# EAGLE design Buck 100V (EAGLE 6.2)
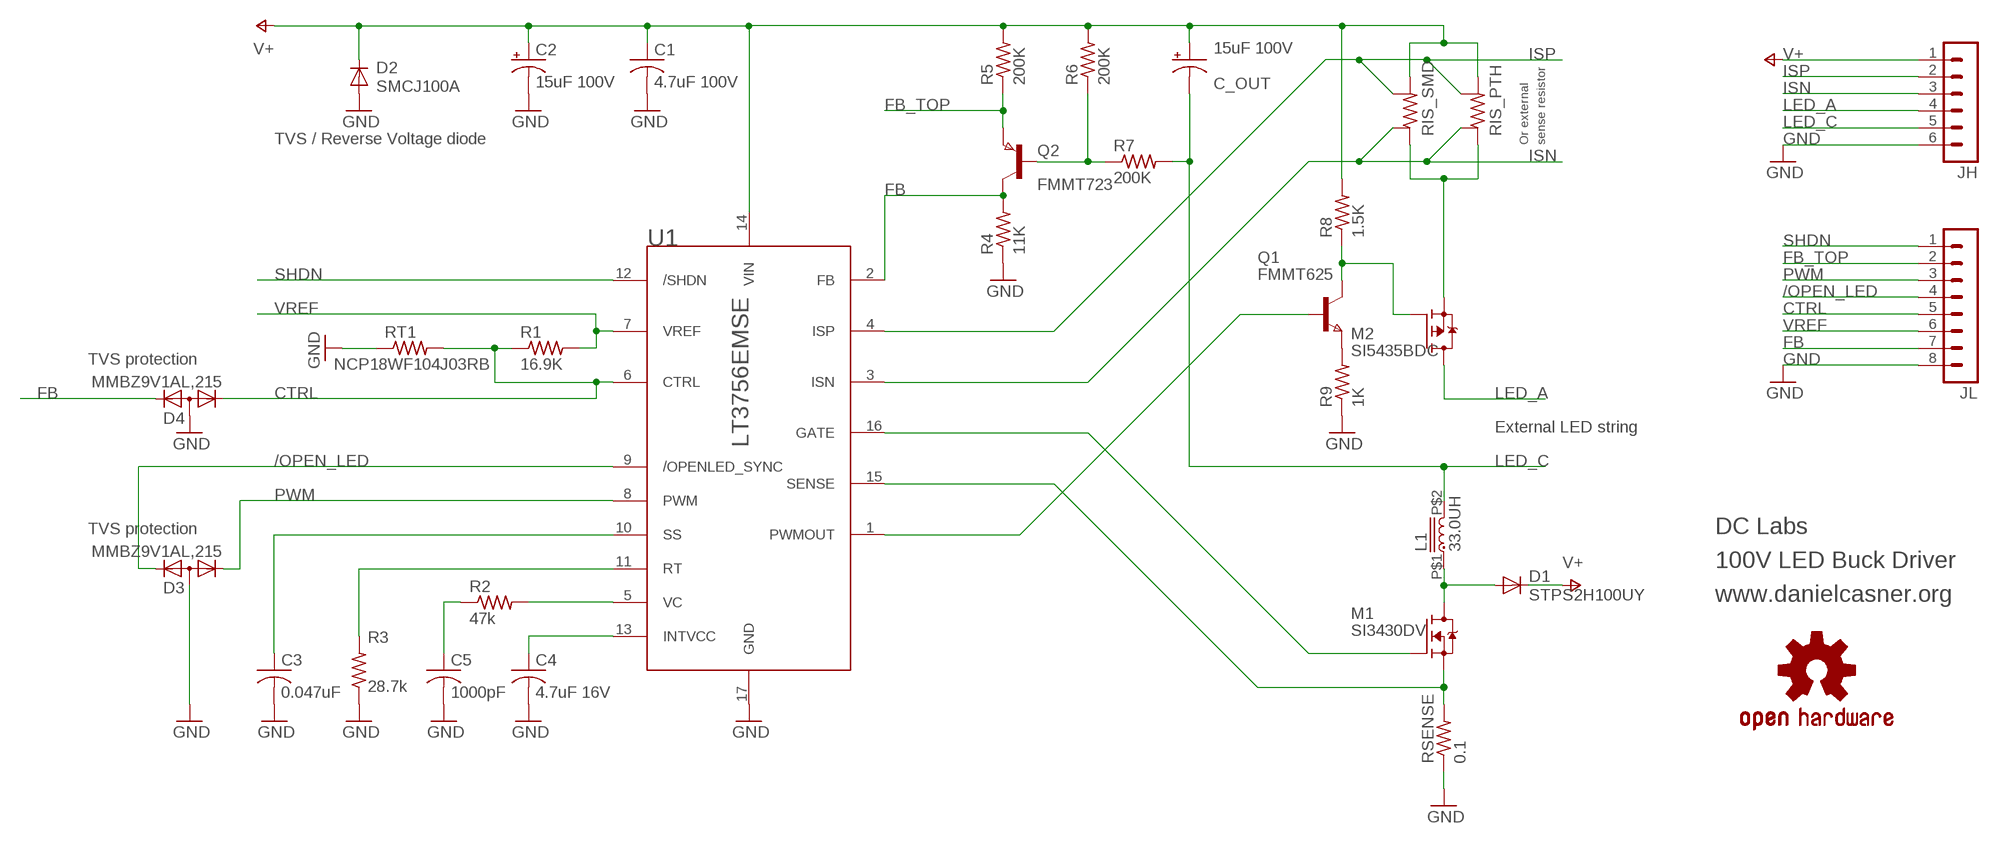
[diagram p0: schematic, sheet 1]

## Parts
C1  4.7uF 100V  C-USC2220K  [C2220K]
C2  15uF 100V  CPOL-USE2,5-6E  [E2,5-6E]
C3  0.047uF  C-USC0805  [C0805]
C4  4.7uF 16V  C-USC0805  [C0805]
C5  1000pF  C-USC0805  [C0805]
C_OUT  15uF 100V  CPOL-USE2,5-6E  [E2,5-6E]
D1  STPS2H100UY  DIODE-SMB  [SMB]
D2  SMCJ100A  DIODE-SMC  [SMC]
D3  MMBZ9V1AL,215  DIODE-2CA|ACSOT23  [SOT23]
D4  MMBZ9V1AL,215  DIODE-2CA|ACSOT23  [SOT23]
JH  MA06-1  [MA06-1]
JL  MA08-1  [MA08-1]
L1  33.0UH  ASPI-0612FS  [ASPI-0612FS]
M1  SI3430DV  [SSOT6]
M2  SI5435BDC  [1206-8CHIP-FET]
Q1  FMMT625  [SOT-23]
Q2  FMMT723  [SOT-23]
R1  16.9K  R-US_R0805  [R0805]
R2  47k  R-US_R0805  [R0805]
R3  28.7k  R-US_R0805  [R0805]
R4  11K  R-US_R0805  [R0805]
R5  200K  R-US_R0805  [R0805]
R6  200K  R-US_R0805  [R0805]
R7  200K  R-US_R0805  [R0805]
R8  1.5K  R-US_R0805  [R0805]
R9  1K  R-US_R0805  [R0805]
RIS_PTH  R-KELVIN0204/7  [0204/7-KELVIN]
RIS_SMD  R-KELVINR2512  [R2512_KELVIN]
RSENSE  0.1  R-US_R0805  [R0805]
RT1  NCP18WF104J03RB  R-US_R0805  [R0805]
U1  LT3756EMSE  [MSOP16EXP]
U$1  OSHW-LOGOS  [OSHW-LOGO-S]

## Nets
/OPEN_LED: D3.2(K2) JL.4 U1.9(/OPENLED_SYNC)
CTRL: D4.1(K1) JL.5 R1.1 RT1.2 U1.6(CTRL)
FB: D4.2(K2) JL.7 Q2.1(C) R4.2 U1.2(FB)
FB_TOP: JL.2 Q2.2(E) R5.1
GND: C1.2 C2.- C3.2 C4.2 C5.2 D2.A D3.3(A) D4.3(A) JH.6 JL.8 R3.1 R4.1 R9.1 RSENSE.1 RT1.1 U1.17(GND)
ISN: JH.3 RIS_PTH.1S RIS_SMD.1S U1.3(ISN)
ISP: JH.2 RIS_PTH.2S RIS_SMD.2S U1.4(ISP)
LED_A: JH.4 M2.1(D) M2.2(D) M2.3(D) M2.6(D) M2.7(D) M2.8(D)
LED_C: C_OUT.- JH.5 L1.P$2 R7.2
N$1: C3.1 U1.10(SS)
N$2: C4.1 U1.13(INTVCC)
N$3: R2.2 U1.5(VC)
N$4: C5.1 R2.1
N$5: R3.2 U1.11(RT)
N$7: M2.5(S) RIS_PTH.1 RIS_SMD.1
N$8: Q2.3(B) R6.1 R7.1
N$9: M2.4(G) Q1.1(C) R8.1
N$10: Q1.2(E) R9.2
N$11: Q1.3(B) U1.1(PWMOUT)
N$13: M1.3(G) U1.16(GATE)
N$14: M1.4(S) RSENSE.2 U1.15(SENSE)
N_BUCK: D1.A L1.P$1 M1.1(D) M1.2(D) M1.5(D) M1.6(D)
PWM: D3.1(K1) JL.3 U1.8(PWM)
SHDN: JL.1 U1.12(/SHDN)
V+: C1.1 C2.+ C_OUT.+ D1.C D2.C JH.1 R5.2 R6.2 R8.2 RIS_PTH.2 RIS_SMD.2 U1.14(VIN)
VREF: JL.6 R1.2 U1.7(VREF)

## Notes on the sheet
- TVS / Reverse Voltage diode | Or external | sense resistor
- TVS protection
- External LED string
- TVS protection | DC Labs
- 100V LED Buck Driver
- www.danielcasner.org

## Library data of the parts
C1 C3-C5 = rcl:C-US: CAPACITOR, American symbol
C2 C_OUT = rcl:CPOL-US: POLARIZED CAPACITOR, American symbol
D1 D2 = diode:DIODE-: DIODE
D3 D4 = diode:DIODE-2CA|AC: Dual DIODE Cathode-Anode|Anode-Cathode
JH = con-lstb:MA06-1: PIN HEADER; OC_FARNELL: unknown; OC_NEWARK: unknown
JL = con-lstb:MA08-1: PIN HEADER; OC_FARNELL: unknown; OC_NEWARK: unknown
L1 = LED-drivers:ASPI-0612FS: Low profile shielded SMD chip power inductor Small size and low profile: 1.2mm Small DCR and high rated current High reliability to mechanical strength Magnetically shielded by magnetic powder molding Suitable for RoHS reflow profile Data Sheet <http://www.abracon.com/Magnetics/new/ASPI-0612FS.pdf>
M1 = LED-drivers:SI3430DV: N-Channel 100-V (D-S) MOSFET
M2 = LED-drivers:SI5435BDC: Si5435BDC P-Channel 30-V (D-S) MOSFET
Q1 = zetex:FMMT6*: NPN SILICON POWER (SWITCHING) TRANSISTORS SuperSOT Source: http://www.zetex.com/3.0/pdf/FMMT617.pdf; MPN: FMMT618; OC_FARNELL: 9526439; OC_NEWARK: 96K9967
Q2 = zetex:FMMT7*: PNP SILICON POWER (SWITCHING) TRANSISTORS SuperSOT Source: http://www.zetex.com/3.0/pdf/FMMT717.pdf; OC_FARNELL: unknown; OC_NEWARK: unknown
R1-R9 RSENSE RT1 = rcl:R-US_: RESISTOR, American symbol
RIS_PTH RIS_SMD = LED-drivers:R-KELVIN
U1 = LED-drivers:LT3756: 100VIN, 100VOUT LED Controller In MSOP16 package with exposed pad The LT®3756, LT3756-1 and LT3756-2 are DC/DC controllers designed to operate as a constant-current source for driving high current LEDs. They drive a low side external N-channel power MOSFET from an internal regulated 7.15V supply. The fixed frequency, current-mode architecture results in stable operation over a wide range of supply and output voltages. A ground referenced voltage FB pin serves as the input for several LED protection features, and also makes it possible for the converter to operate as a constant-voltage source. A frequency adjust pin allows the user to program the frequency from 100kHz to 1MHz to optimize efficiency, performance or external component size. The LT3756/LT3756-1/LT3756-2 sense output current at the high side of the LED string. High side current sensing is the most flexible scheme for driving LEDs, allowing boost, buck mode or buck-boost mode configuration. The PWM input provides LED dimming ratios of up to 3000:1, and the CTRL input provides additional analog dimming capability.
U$1 = SparkFun-Aesthetics:OSHW-LOGO: Open Source Hardware Logo This logo indicates the piece of hardware it is found on incorporates a OSHW license and/or adheres to the definition of open source hardware found here: http://freedomdefined.org/OSHW

## Board
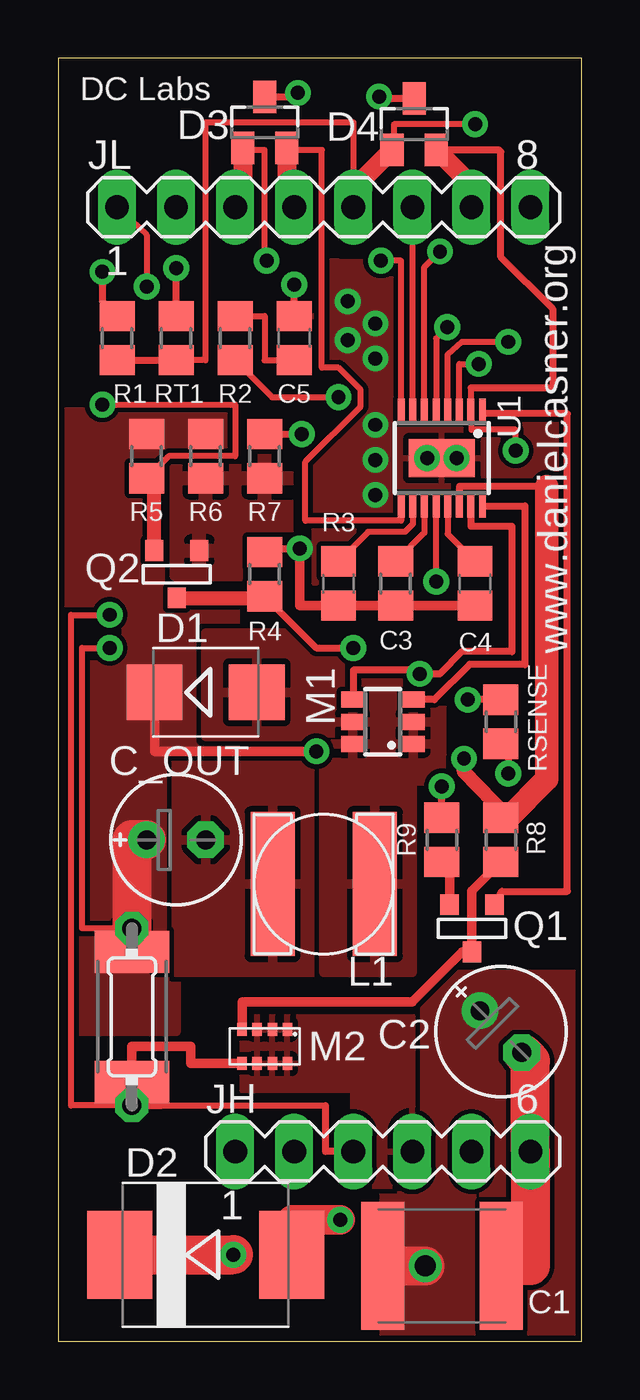
[diagram p1: board, top side]
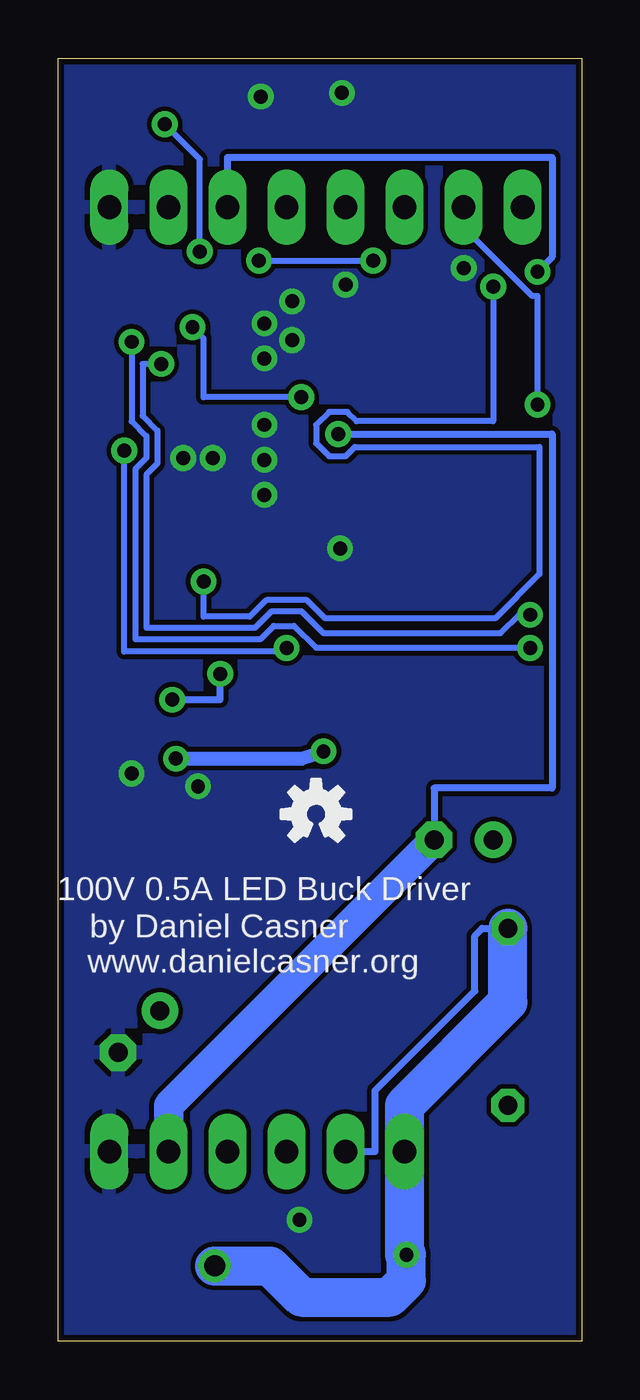
[diagram p2: board, bottom side, seen from below]

Size 22.53 x 55.23 mm. Coordinates in mm from the lower left corner, seen from the top.
Outline: 0,0 22.53,0 22.53,55.23 0,55.23 0,0
Copper layers (1*16): Top 0.035mm / dielectric 1.5mm / Bottom 0.035mm
Design rules: minimum track width 8mil, minimum drill 20mil, track to track 8mil, track to pad 8mil, pad to pad 8mil, via to via 8mil, smd to smd 8mil, copper to edge 10mil, drill to drill 8mil, minimum pad ring 12mil, minimum via ring 10mil, stop-mask expansion 4mil, vias tented up to drill 25mil, thermal gap 10mil

### Footprints (pad centres in the part's own frame; a part is rotated, then mirrored left to right if it is on the bottom)
C2220K = smd 1.85 x 5.5: 1 -2.55,0; 2 2.55,0
E2,5-6E = drill 0.813 pad 1.575: + -1.27,0 | drill 0.813 pad 1.575 octagon: - 1.27,0
C0805 = smd 1.3 x 1.5: 1 -0.95,0; 2 0.95,0
SMB = smd 2.4 x 2.4: A 2.2,0; C -2.2,0
SMC = smd 2.8 x 3.8: A 3.7,0; C -3.7,0
SOT23 = smd 1 x 1.4: 1 -0.95,-1.1; 2 0.95,-1.1; 3 0,1.1
MA06-1 = drill 1.016 long: 1 -6.35,0; 2 -3.81,0; 3 -1.27,0; 4 1.27,0; 5 3.81,0; 6 6.35,0
MA08-1 = drill 1.016 long: 1 -8.89,0; 2 -6.35,0; 3 -3.81,0; 4 -1.27,0; 5 1.27,0; 6 3.81,0; 7 6.35,0; 8 8.89,0
ASPI-0612FS = smd 1.9 x 6.2: P$1 -2.2,0; P$2 2.2,0
SSOT6 = smd 0.69 x 0.99: 1 -0.95,-1.3; 2 0,-1.3; 3 0.95,-1.3; 4 0.95,1.3; 5 0,1.3; 6 -0.95,1.3
1206-8CHIP-FET = smd 0.406 x 0.56: 1 -0.975,-0.737; 2 -0.325,-0.737; 3 0.325,-0.737; 4 0.975,-0.737; 5 0.975,0.737; 6 0.325,0.737; 7 -0.325,0.737; 8 -0.975,0.737
SOT-23 = smd 0.787 x 0.889: 1 0.025,-1.016; 2 -0.94,1.016; 3 0.991,1.016
R0805 = smd 1.3 x 1.5: 1 -0.95,0; 2 0.95,0
0204/7-KELVIN = drill 0.813 octagon: 1 -3.81,0; 1S -3.81,0; 2 3.81,0; 2S 3.81,0
R2512_KELVIN = smd 1.8 x 3.2: 1 -2.8,0; 2 2.8,0 | smd 1.27 x 0.635: 1S -2.54,-1.27; 2S 2.54,-1.27
MSOP16EXP = smd 0.3 x 1: 1 -1.75,-2.05; 2 -1.25,-2.05; 3 -0.75,-2.05; 4 -0.25,-2.05; 5 0.25,-2.05; 6 0.75,-2.05; 7 1.25,-2.05; 8 1.75,-2.05; 9 1.75,2.06; 10 1.25,2.06; 11 0.75,2.06; 12 0.25,2.06; 13 -0.25,2.06; 14 -0.75,2.06; 15 -1.25,2.06; 16 -1.75,2.06 | smd 2.845 x 1.651: 17 0,0

### Placement (x,y rotation side)
C1  16.51,3.25 0 top
C2  19.05,13.34 315 top
C3  12.06,32.62 270 top
C4  17.94,32.62 270 top
C5  10.16,43.18 90 top
C_OUT  5.08,21.59 0 top
D1  6.35,27.94 0 top
D2  6.35,3.73 0 top
D3  8.89,52.47 0 top
D4  15.32,52.39 0 top
JH  13.97,8.18 0 top
JL  11.43,48.82 0 top
L1  11.43,19.68 180 top
M1  13.97,26.67 90 top
M2  8.89,12.7 180 top
Q1  17.78,17.78 0 top
Q2  5.08,33.02 0 top
R1  2.54,43.18 90 top
R2  7.62,43.18 270 top
R3  14.53,32.62 90 top
R4  8.89,33.02 270 top
R5  3.81,38.1 90 top
R6  6.35,38.1 90 top
R7  8.89,38.1 90 top
R8  19.05,21.59 90 top
R9  16.51,21.59 270 top
RIS_PTH  3.17,13.97 90 top
RIS_SMD  3.17,13.97 90 top
RSENSE  19.05,26.67 90 top
RT1  5.08,43.18 270 top
U1  16.51,38.02 180 top
U$1  11.43,22.7 0 bottom

### Tracks (layer width: path | path; a pad name or v marks a point on that pad's centre or on a via)
/OPEN_LED
  Top 0.254: U1.9 arc-90 U1.9 14.76,35.32 10.64,35.32 10.64,37.86 13.02,40.24 13.02,40.96 12.06,41.91 11.35,41.91 11.35,51.28 9.92,51.28 | 9.92,51.28 9.92,51.2 | 9.92,51.28 9.84,51.28 D3.2
  Top 0.813: D3.2 9.84,48.99 JL.4
CTRL  (via drill 0.6)
  Top 0.254: RT1.2 6.35,42.23 6.35,52.47 12.7,52.47 JL.5 | U1.6 15.76,46.24 v16.43,46.91 | v17.94,52.39 14.45,52.39 14.45,51.29 D4.1
  Top 0.305: R1.1 RT1.2
  Top 0.813: D4.1 12.7,49.62 JL.5
  Bottom 0.254: v16.43,46.91 16.43,50.88 v17.94,52.39
FB  (via drill 0.6)
  Top 0.254: v19.68,38.34 19.68,39.24 17.78,39.24 17.78,40.07 U1.2 17.76,41.04
  Top 0.305: 17.76,41.04 21.27,41.04 21.27,44.45 19.05,46.67 19.05,51.2 18.97,51.28 16.27,51.28 D4.2 | R4.2 11.12,29.84 v12.7,29.84
  Top 0.61: Q2.1 8.82,32 R4.2
  Top 0.813: D4.2 17.78,49.78 JL.7
  Bottom 0.254: v12.7,29.84 12.78,29.84 12.94,29.69 19.68,29.69 v19.68,38.34
FB_TOP  (via drill 0.6)
  Top 0.254: v1.91,40.32 7.62,40.32 7.62,38.1 4.76,38.1 R5.1
  Top 0.61: Q2.2 4.14,36.82 R5.1
  Bottom 0.254: v1.91,40.32 1.91,45.01 2.14,45.01 5.08,47.94 JL.2
GND  (via drill 0.6)
  Top 0.254: v15.88,38.02 U1.17
  Top 0.305: R9.1 v16.51,23.89 | RSENSE.1 19.21,25.72 19.37,25.72 v19.37,24.45 | R4.1 9.21,33.97 9.29,34.13 v10.4,34.13 | C5.2 v10.16,45.48 | RT1.1 v5.08,46.2 | D3.3 10.31,53.57 v10.32,53.74 | D4.3 13.9,53.49 v13.81,53.58
  Top 0.406: v10.4,34.13 10.4,31.67 C3.2 R3.1 C4.2
  Top 1.27: D2.A 10.08,5.24 v12.14,5.24
  Top 1.676: C1.2 20.32,3.26 JH.6 20.32,12.06 20,12.38
  other vias: 17.14,38.02 13.65,36.43 13.65,37.94 13.65,39.45 13.65,42.31 12.46,44.77 13.65,43.81 12.46,43.1
  pour Bottom: 0,55.24 0,0 22.23,0 22.23,55.24
  pour Top (rank 5): 22.54,46.28 22.54,32.38 11.03,32.62 11.03,46.51
ISN  (via drill 0.6)
  Top 0.254: v2.22,31.27 0.56,31.27 0.56,10.16 RIS_PTH.1S 11.51,10.16 | U1.3 17.26,42.07 v18.1,42.07
  Top 0.305: JH.3 11.51,8.18 11.51,10.16 | RIS_PTH.1S 4.45,10.16 RIS_SMD.1S
  Bottom 0.254: v18.1,42.07 18.89,42.07 18.89,39.85 18.26,39.21 18.26,37.78 18.73,37.31 18.73,30.72 14.05,30.72 13.34,31.43 12.06,31.43 11.11,30.48 3.49,30.48 2.7,31.27 v2.22,31.27
ISP  (via drill 0.6)
  Top 0.254: RIS_PTH.2S 1.03,17.78 1.03,29.84 v2.22,29.84 | U1.4 16.76,42.47 17.38,43.02 v19.37,43.02
  Top 0.305: RIS_SMD.2S RIS_PTH.2S
  Bottom 0.254: v2.22,29.84 11.43,29.84 12.38,30.8 13.26,30.8 13.81,30.23 19.21,30.23 19.21,37.54 18.73,38.02 18.73,38.97 19.37,39.61 v19.37,43.02
  Bottom 0.305: JH.2 8.89,8.18 8.89,10.79 4.6,15.08 4.6,17.46 4.29,17.78 RIS_PTH.2S
LED_A
  pour Top: 7.94,13.97 15.24,13.97 15.24,6.67 12.7,6.67 12.7,10.79 7.94,10.79
LED_C  (via drill 0.6)
  Top 0.305: R7.2 v10.48,39.05
  Bottom 0.305: v10.48,39.05 1.27,39.05 1.27,23.81 6.35,23.81 C_OUT.-
  Bottom 1.27: JH.5 17.78,10.16 C_OUT.-
  pour Top (rank 2): 5.08,25.4 5.08,15.88 11.43,15.88 11.43,25.4
N$1
  Top 0.254: U1.10 15.26,35.18 14.92,34.85 13.34,34.85 C3.1
N$2
  Top 0.254: U1.13 16.76,34.75 C4.1
N$3  (via drill 0.6)
  Top 0.254: R2.2 9.21,40.64 v12.06,40.64 | v16.75,43.66 16.26,43.17 U1.5
  Bottom 0.254: v12.06,40.64 16.27,40.64 16.27,43.18 v16.75,43.66
N$4
  Top 0.254: R2.1 8.89,44.13 8.89,42.23 C5.1
N$5
  Top 0.254: U1.11 15.76,34.81 R3.2
N$7
  Top 0.406: RIS_PTH.1 RIS_SMD.1 3.17,12.7 5.71,12.7 5.71,11.96 M2.5
N$8
  pour Top: 5.08,33.02 9.84,33.02 9.84,38.1 5.08,38.1
N$9
  Top 0.406: M2.4 7.92,14.61 15.24,14.61 17.4,16.76 Q1.1 17.8,19.39 R8.1
N$10
  Top 0.406: Q1.2 16.84,20.31 R9.2
N$11
  Top 0.305: Q1.3 19.09,19.37 21.91,19.37 21.91,39.93 18.26,39.93 U1.1
N$13
  Top 0.305: U1.16 20.08,35.96 20.08,29.13 17.7,29.13 16.19,27.62 M1.3
N$14  (via drill 0.6)
  Top 0.305: U1.15 17.76,35.08 19.53,35.08 19.53,29.69 17.36,29.69 16.43,28.73 v15.56,28.73 15.56,28.89 12.7,28.89 12.7,27.65 M1.4 | RSENSE.2 17.78,27.62 v17.62,27.62
  Bottom 0.305: v17.62,27.62 15.56,27.62 v15.56,28.73
N_BUCK
  pour Top: 11.43,15.88 15.24,15.88 15.24,24.13 16.51,24.13 16.51,30.48 6.35,30.48 6.35,26.04 11.43,26.04
PWM  (via drill 0.6)
  Top 0.254: U1.8 14.76,44.3 14.76,46.51 v13.89,46.51 | v8.97,46.51 8.89,46.51 8.89,51.28 7.94,51.28 D3.1
  Top 0.813: D3.1 7.94,49.06 JL.3
  Bottom 0.254: v13.89,46.51 v8.97,46.51
SHDN  (via drill 0.6)
  Top 0.254: JL.1 3.81,47.62 v3.81,45.4 | v16.27,32.7 16.26,33.42 U1.12
  Bottom 0.254: v3.81,45.4 3.81,39.61 9.68,39.61 10.08,40.01 10.87,40.01 11.43,39.45 11.43,38.66 10.87,38.1 10.16,38.1 9.76,38.5 1.83,38.5 1.83,33.02 3.73,31.11 11.03,31.11 11.83,31.91 13.57,31.91 14.29,31.19 16.27,31.19 v16.27,32.7
V+  (via drill 0.6, 0.9)
  Top 0.305: RIS_PTH.2 RIS_SMD.2 | R8.2 19.36,22.54 | 21.03,36.8 17.26,36.8 U1.14
  Top 0.406: 19.36,22.54 19.36,22.55 | v11.11,25.4 4.15,25.4 D1.C
  Top 0.61: 19.36,22.55 17.46,24.53 v17.46,25.08
  Top 1.016: 21.03,36.8 21.03,24.21 19.36,22.54
  Top 1.676: D2.C v7.54,3.73 | C1.1 v15.8,3.25 | C_OUT.+ 3.17,21.59 RIS_PTH.2
  Bottom 0.61: v17.46,25.08 12.06,25.08 v11.11,25.4
  Bottom 1.676: RIS_PTH.2 3.17,14.61 7.62,10.16 JH.1 7.62,3.73 v7.54,3.73 7.54,2.62 8.26,1.91 12.06,1.91 13.41,3.25 v15.8,3.25
  pour Top (rank 3, no thermals): 7.62,40.01 7.62,24.77 5.08,24.77 5.08,13.34 0,13.34 0,40.01
  pour Top (rank 5, no thermals): 22.54,15.88 22.54,0 13.97,0 13.97,15.88
VREF  (via drill 0.6)
  Top 0.254: U1.7 15.26,48.24 JL.6
  Top 0.305: v1.91,46.04 1.91,44.77 R1.2
  Bottom 0.305: JL.6 15.24,50.96 1.27,50.96 1.27,46.67 v1.91,46.04

### Text on the board
tNames: DC Labs | www.danielcasner.org
bNames: 100V 0.5A LED Buck Driver | by Daniel Casner | www.danielcasner.org